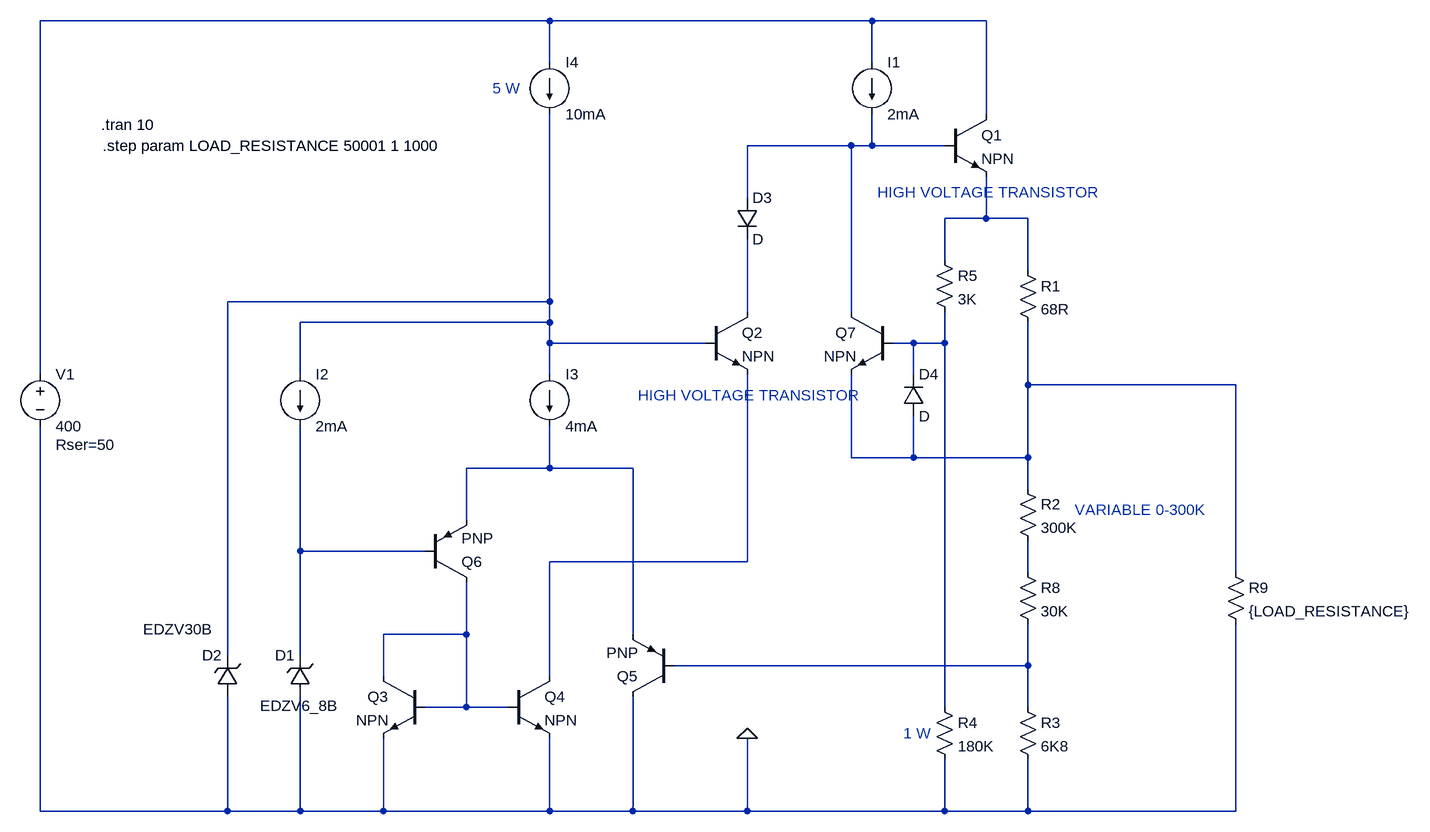
[diagram p0: schematic HighVoltage.asc]
HighVoltage.asc, the LTspice schematic file:
Version 4
SHEET 1 1292 904
WIRE -144 -464 -928 -464
WIRE 352 -464 -144 -464
WIRE 528 -464 352 -464
WIRE -144 -400 -144 -464
WIRE 352 -400 352 -464
WIRE 528 -320 528 -464
WIRE 320 -272 160 -272
WIRE 352 -272 352 -320
WIRE 352 -272 320 -272
WIRE 464 -272 352 -272
WIRE 160 -192 160 -272
WIRE 528 -160 528 -224
WIRE 528 -160 464 -160
WIRE 592 -160 528 -160
WIRE 464 -96 464 -160
WIRE 592 -80 592 -160
WIRE -144 -32 -144 -320
WIRE -144 -32 -640 -32
WIRE 160 -16 160 -128
WIRE 320 -16 320 -272
WIRE -144 0 -144 -32
WIRE -144 0 -528 0
WIRE -144 32 -144 0
WIRE 96 32 -144 32
WIRE 416 32 384 32
WIRE 464 32 464 -16
WIRE 464 32 416 32
WIRE -928 80 -928 -464
WIRE -528 80 -528 0
WIRE -144 80 -144 32
WIRE 416 80 416 32
WIRE 592 96 592 0
WIRE 912 96 592 96
WIRE 320 208 320 80
WIRE 416 208 416 144
WIRE 416 208 320 208
WIRE 592 208 592 96
WIRE 592 208 416 208
WIRE -144 224 -144 160
WIRE -144 224 -272 224
WIRE -16 224 -144 224
WIRE 592 256 592 208
WIRE -272 304 -272 224
WIRE -528 352 -528 160
WIRE -336 352 -528 352
WIRE 160 368 160 80
WIRE 160 368 -144 368
WIRE 592 384 592 336
WIRE 912 384 912 96
WIRE -272 480 -272 400
WIRE -272 480 -400 480
WIRE -16 480 -16 224
WIRE -640 512 -640 -32
WIRE -528 512 -528 352
WIRE 592 528 592 464
WIRE 592 528 48 528
WIRE -400 544 -400 480
WIRE -144 544 -144 368
WIRE -272 592 -272 480
WIRE -272 592 -336 592
WIRE -208 592 -272 592
WIRE 464 592 464 32
WIRE 592 592 592 528
WIRE -928 752 -928 160
WIRE -640 752 -640 576
WIRE -640 752 -928 752
WIRE -528 752 -528 576
WIRE -528 752 -640 752
WIRE -400 752 -400 640
WIRE -400 752 -528 752
WIRE -144 752 -144 640
WIRE -144 752 -400 752
WIRE -16 752 -16 576
WIRE -16 752 -144 752
WIRE 160 752 160 640
WIRE 160 752 -16 752
WIRE 464 752 464 672
WIRE 464 752 160 752
WIRE 592 752 592 672
WIRE 592 752 464 752
WIRE 912 752 912 464
WIRE 912 752 592 752
FLAG 160 640 0
SYMBOL npn2 464 -320 R0
SYMATTR InstName Q1
SYMBOL npn2 96 -16 R0
SYMATTR InstName Q2
SYMBOL npn2 -336 544 M0
SYMATTR InstName Q3
SYMBOL npn2 -208 544 R0
SYMATTR InstName Q4
SYMBOL res 576 -96 R0
SYMATTR InstName R1
SYMATTR Value 68R
SYMBOL res 576 240 R0
SYMATTR InstName R2
SYMATTR Value 300K
SYMBOL pnp2 48 576 R180
SYMATTR InstName Q5
SYMBOL pnp2 -336 400 M180
SYMATTR InstName Q6
SYMBOL res 576 576 R0
SYMATTR InstName R3
SYMATTR Value 6K8
SYMBOL npn2 384 -16 M0
SYMATTR InstName Q7
SYMBOL zener -512 576 R180
WINDOW 0 24 64 Left 2
WINDOW 3 -42 -14 Left 2
SYMATTR InstName D1
SYMATTR Value EDZV6_8B
SYMBOL zener -624 576 R180
WINDOW 0 24 64 Left 2
WINDOW 3 39 104 Left 2
SYMATTR InstName D2
SYMATTR Value EDZV30B
SYMBOL voltage -928 64 R0
WINDOW 123 0 0 Left 2
WINDOW 39 24 124 Left 2
SYMATTR InstName V1
SYMATTR Value 400
SYMATTR SpiceLine Rser=50
SYMBOL res 448 576 R0
SYMATTR InstName R4
SYMATTR Value 180K
SYMBOL res 448 -112 R0
SYMATTR InstName R5
SYMATTR Value 3K
SYMBOL current 352 -400 R0
WINDOW 123 0 0 Left 2
WINDOW 39 0 0 Left 2
SYMATTR InstName I1
SYMATTR Value 2mA
SYMBOL res 896 368 R0
SYMATTR InstName R9
SYMATTR Value {LOAD_RESISTANCE}
SYMBOL current -528 80 R0
WINDOW 123 0 0 Left 2
WINDOW 39 0 0 Left 2
SYMATTR InstName I2
SYMATTR Value 2mA
SYMBOL diode 144 -192 R0
SYMATTR InstName D3
SYMBOL res 576 368 R0
SYMATTR InstName R8
SYMATTR Value 30K
SYMBOL current -144 80 R0
WINDOW 123 0 0 Left 2
WINDOW 39 0 0 Left 2
SYMATTR InstName I3
SYMATTR Value 4mA
SYMBOL current -144 -400 R0
WINDOW 123 0 0 Left 2
WINDOW 39 0 0 Left 2
SYMATTR InstName I4
SYMATTR Value 10mA
SYMBOL diode 400 144 M180
WINDOW 0 24 64 Left 2
WINDOW 3 24 0 Left 2
SYMATTR InstName D4
TEXT -834 -304 Left 2 !.tran 10
TEXT 664 288 Left 2 ;VARIABLE 0-300K
TEXT -8 112 Left 2 ;HIGH VOLTAGE TRANSISTOR
TEXT 360 -200 Left 2 ;HIGH VOLTAGE TRANSISTOR
TEXT -832 -272 Left 2 !.step param LOAD_RESISTANCE 50001 1 1000
TEXT -232 -360 Left 2 ;5 W
TEXT 400 632 Left 2 ;1 W

The netlist it stands for:
* HighVoltage.asc
Q1 N001 N002 N003 0 NPN
Q2 N005 N004 N010 0 NPN
Q3 N012 N012 0 0 NPN
Q4 N010 N012 0 0 NPN
R1 N003 N007 68R
R2 N007 N011 300K
Q5 0 N013 N008 0 PNP
Q6 N012 N009 N008 0 PNP
R3 N013 0 6K8
Q7 N002 N006 N007 0 NPN
D1 0 N009 EDZV6_8B
D2 0 N004 EDZV30B
V1 N001 0 400 Rser=50
R4 N006 0 180K
R5 N003 N006 3K
I1 N001 N002 2mA
R9 N007 0 {LOAD_RESISTANCE}
I2 N004 N009 2mA
D3 N002 N005 D
R8 N011 N013 30K
I3 N004 N008 4mA
I4 N001 N004 10mA
D4 N007 N006 D
.model D D
.lib standard.dio
.model NPN NPN
.model PNP PNP
.lib standard.bjt
.tran 10
* VARIABLE 0-300K
* HIGH VOLTAGE TRANSISTOR
* HIGH VOLTAGE TRANSISTOR
.step param LOAD_RESISTANCE 50001 1 1000
* 5 W
* 1 W
.backanno
.end